# Altium schematic sheet MCU.SchDoc
size A; Organization: Altium Limited; Address1: L3, 12a Rodborough Rd; Address2: Frenchs Forest; Address3: NSW; Address4: Australia 2086; DocumentNumber: 2; SheetNumber: 2; SheetTotal: 3
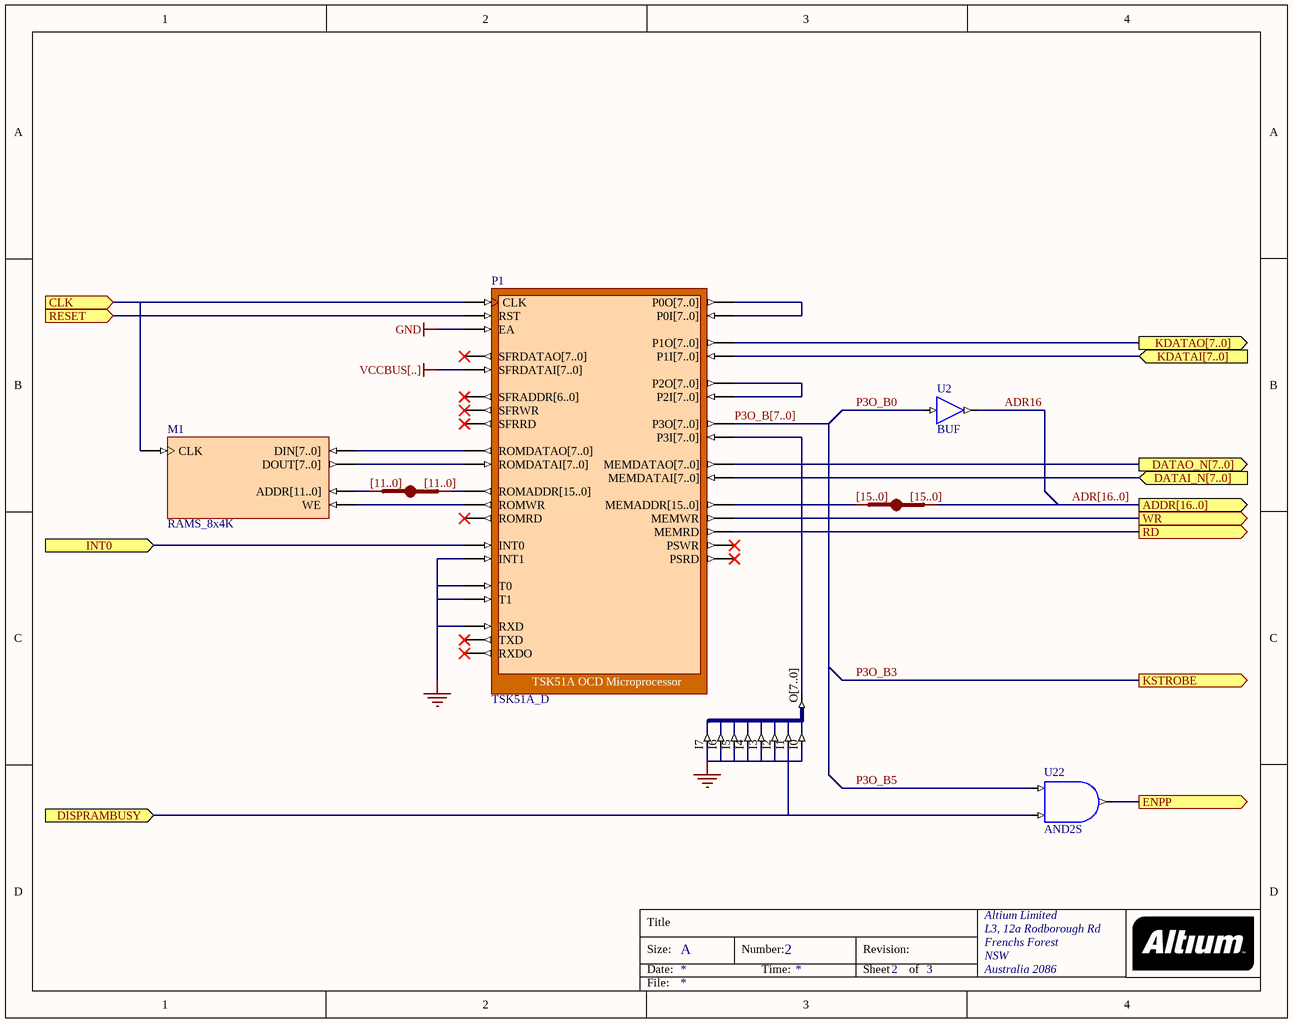
[diagram p0: MCU.SchDoc]

## Parts
M1  RAMS_8x4K
P1  TSK51A_D
U2  BUF
U3  J8S_8B  (value not drawn)
U17  IndexA: [15..0]  (hidden comment: JB)
U18  IndexA: [11..0]  (hidden comment: JB)
U22  AND2S

## Ports
ADDR[16..0] (out), CLK (in), DATAI_N[7..0] (in), DATAO_N[7..0] (out), DISPRAMBUSY (in), ENPP (out), INT0 (in), KDATAI[7..0] (in), KDATAO[7..0] (out), KSTROBE (out), RD (out), RESET (in), WR (out)

## Nets
GND: P1.EA P1.INT1 P1.RXD P1.T0 P1.T1 U3.I0 U3.I2 U3.I3 U3.I4 U3.I5 U3.I6 U3.I7
VCCBUS[..]: P1.SFRDATAI[7..0]
ADR16: U2.O
ADR[16..0]: U17.B[0..0] ; port ADDR[16..0]
CLK: M1.CLK P1.CLK ; port CLK
DATAI_N[7..0]: P1.MEMDATAI[7..0] ; port DATAI_N[7..0]
DATAO_N[7..0]: P1.MEMDATAO[7..0] ; port DATAO_N[7..0]
DISPRAMBUSY: U3.I1 U22.I1 ; port DISPRAMBUSY
ENPP: U22.O ; port ENPP
INT0: P1.INT0 ; port INT0
KDATAI[7..0]: P1.P1I[7..0] ; port KDATAI[7..0]
KDATAO[7..0]: P1.P1O[7..0] ; port KDATAO[7..0]
P3O_B0: U2.I
P3O_B3: port KSTROBE
P3O_B5: U22.I0
P3O_B[7..0]: P1.P3O[7..0]
RD: P1.MEMRD ; port RD
RESET: P1.RST ; port RESET
WR: P1.MEMWR ; port WR
NetM1_ADDR[11..0]: M1.ADDR[11..0] U18.B[0..0]
NetM1_DIN[7..0]: M1.DIN[7..0] P1.ROMDATAO[7..0]
NetM1_DOUT[7..0]: M1.DOUT[7..0] P1.ROMDATAI[7..0]
NetM1_WE: M1.WE P1.ROMWR
NetP1_MEMADDR[15..0]: P1.MEMADDR[15..0] U17.A[0..0]
NetP1_P0I[7..0]: P1.P0I[7..0] P1.P0O[7..0]
NetP1_P2I[7..0]: P1.P2I[7..0] P1.P2O[7..0]
NetP1_P3I[7..0]: P1.P3I[7..0] U3.O[7..0]
NetP1_ROMADDR[15..0]: P1.ROMADDR[15..0] U18.A[0..0]

Not connected (* = marked no-connect by the designer): P1 PSRD* PSWR* ROMRD* RXDO* SFRADDR[6..0]* SFRDATAO[7..0]* SFRRD* SFRWR* TXD*

## Buses and harness runs
bus ADR[16..0] = port ADDR[16..0]
bus P3O_B[7..0]

## Notes on the sheet
- Title
- Size:
- Date:
- A
- Number:
- Time:
- Revision:
- Sheet
- of
- File:

## Library data of the parts
M1 = RAMS_8x4K: Single Port Random Access Memory; Memory_Depth: 4096; Memory_Type: RAM_SinglePortBlock; Memory_Width: 8; Memory_ClockEdge: Rising; Nexus_Core: Memory_Program; Published: 13/01/2004; Publisher: Altium Hobart Technology Center
P1 = TSK51A_D: TSK51A OCD Microprocessor; NEXUS_CORE: Processor_OCDS; NEXUS_JTAG_DEVICE: True; NEXUS_JTAG_ORDER: 0; ChildModel1: RAM256x8_TSK51D; ChildCore1: M1; Published: 10/11/2003; Publisher: Altium Hobart Technology Centre; Core Revision: 1.00.00
U2 = BUF: 1-bit General Purpose (Non-inverting) Buffer; ArchiveName: GENERIC; Published: 18-Nov-2003; Publisher: Altium Limited; Xilinx Equivalent: BUF; Core Revision: 1.00.00
U3 = J8S_8B: 8 Single pin inputs to single 8-Bit output bus; ArchiveName: GENERIC; Published: 18-Dec-2003; Publisher: Altium Limited; Core Revision: 1.00.00
U17 U18 = JB: System BUS Joiner; ArchiveName: GENERIC; Published: 18-Dec-2003; Publisher: Altium Limited; Core Revision: 1.00.00
  U17: IndexB: [15..0]
  U18: IndexB: [11..0]
U22 = AND2S: 2-Input AND Gate, Single Pin Version; Xilinx Equivalent: AND2; ArchiveName: GENERIC; Published: 18-Nov-2003; Publisher: Altium Limited; Core Revision: 1.00.00